# Altium schematic sheet dual_CAN_conn.SchDoc
size A4; SheetNumber: 7; SheetTotal: 8
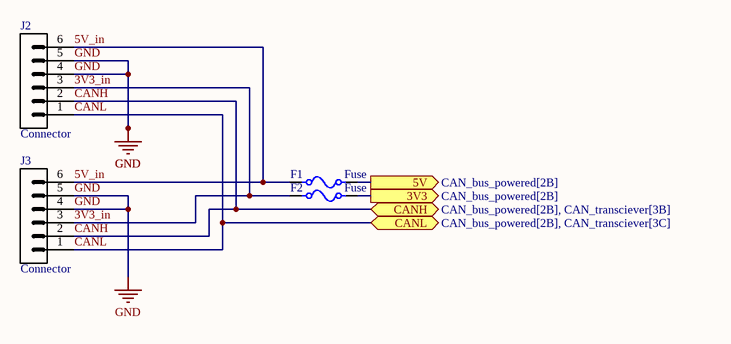
[diagram p0: dual_CAN_conn.SchDoc]

## Parts
F1  Fuse
F2  Fuse
J2  Connector
J3  Connector

## Ports
3V3 (out, see CAN_bus_powered[2B]), 5V (out, see CAN_bus_powered[2B]), CANH (bidir, see CAN_bus_powered[2B], CAN_transciever[3B]), CANL (bidir, see CAN_bus_powered[2B], CAN_transciever[3C])

## Nets
GND: J2.4 J2.5 J3.4 J3.5
3V3: F2.2 ; port 3V3
3V3_in: F2.1 J2.3 J3.3
5V: F1.2 ; port 5V
5V_in: F1.1 J2.6 J3.6
CANH: J2.2 J3.2 ; port CANH
CANL: J2.1 J3.1 ; port CANL

## Library data of the parts
J2 J3 = Connector 6-Pin 1 Row: 6 Pin 1 Row Connector